# Altium schematic sheet headers.SchDoc
size A; SheetNumber: 2; SheetTotal: 3
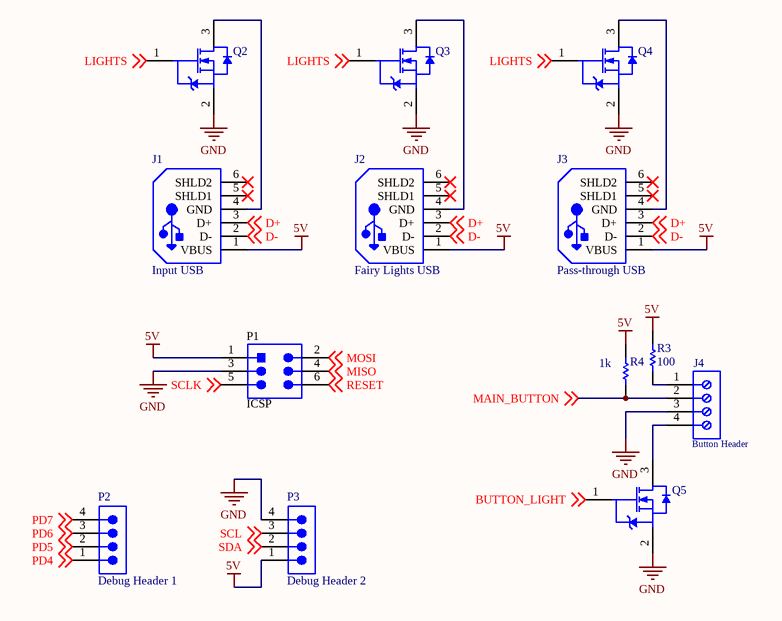
[diagram p0: headers.SchDoc]

## Parts
J1  Input USB  [TE-292303-1_V]
J2  Fairy Lights USB  [TE-292303-1_V]
J3  Pass-through USB  [TE-292303-1_V]
J4  Button Header  [691508110304]
P1  ICSP  [SMTC-TSW-103-08-L-D_V]
P2  Debug Header 1  [SMTC-TSW-104-08-X-S]
P3  Debug Header 2  [SMTC-TSW-104-08-X-S]
Q2  (no value)  [FAIR-FDV303N-3_V]
Q3  (no value)  [FAIR-FDV303N-3_V]
Q4  (no value)  [FAIR-FDV303N-3_V]
Q5  (no value)  [FAIR-FDV303N-3_V]
R3  100  [RESC2013X50X30LL20T20]
R4  1k  [RESC2013X50X30NL20T20]

## Nets
5V: J1.1(VBUS) J2.1(VBUS) J3.1(VBUS) P1.1 P3.1 R3.2 R4.2
GND: J4.3 P1.3 P3.4 Q2.2(S) Q3.2(S) Q4.2(S) Q5.2(S)
BUTTON_LIGHT: Q5.1(G) ; off-sheet BUTTON_LIGHT
D+: J1.3(D+) J2.3(D+) J3.3(D+) ; off-sheet D+
D-: J1.2(D-) J2.2(D-) J3.2(D-) ; off-sheet D-
LIGHTS: Q2.1(G) Q3.1(G) Q4.1(G) ; off-sheet LIGHTS
MAIN_BUTTON: J4.2 R4.1 ; off-sheet MAIN_BUTTON
MISO: P1.4 ; off-sheet MISO
MOSI: P1.2 ; off-sheet MOSI
PD4: P2.1 ; off-sheet PD4
PD5: P2.2 ; off-sheet PD5
PD6: P2.3 ; off-sheet PD6
PD7: P2.4 ; off-sheet PD7
RESET: P1.6 ; off-sheet RESET
SCL: P3.3 ; off-sheet SCL
SCLK: P1.5 ; off-sheet SCLK
SDA: P3.2 ; off-sheet SDA
NetJ1_4: J1.4(GND) Q2.3(D)
NetJ2_4: J2.4(GND) Q3.3(D)
NetJ3_4: J3.4(GND) Q4.3(D)
NetJ4_1: J4.1 R3.1
NetJ4_4: J4.4 Q5.3(D)

Not connected (* = marked no-connect by the designer): J1 5(SHLD1)* 6(SHLD2)*; J2 5(SHLD1)* 6(SHLD2)*; J3 5(SHLD1)* 6(SHLD2)*

## Library data of the parts
J1-J3 = CMP-2000-05404-1: 1 Port Right Angle Through Hole Mount Female Type A USB Connector, 4 Position, -55 to 85 degC, RoHS, Tube; Manufacturer: TE Connectivity; MPN: 292303-1; Contact Termination Type: Solder; No. of Contacts: 4; Connector Mounting: PCB; SVHC: NoSVHC(16-Jun-2014); Gender: Receptacle; Connector Type: USBA; Package Description: 4-Pin Through Hole Device, Body 14 x 13.13 mm, Pitch 2.5 mm; Contact Plating: Gold; Package Reference: 292303-1; Contact Material: Copper; Datasheet URL: http://www.farnell.com/cad/1653030.pdf; Datasheet Version: Feb-12; Manufacturer URL: http://www.te.com/
J4 = CMP-1502-02492-1: Serie 5081 - 3.50 mm Horizontal Entry SMT with Rising Cage Clamp WR-TBL, 4 pin; Manufacturer: Wurth Elektronik; Pitch: 3.50mm; Pin Number: 4; Package Reference: 691508110304; Publisher: WurthElektronik; Part Number: 691508110304; Datasheet URL: http://katalog.we-online.de/em/datasheet/6915081103xx.pdf; Mounting Technology: SMT; Operating Temperature: -40to130degC; Packaging: TapeandReelwithCap; Manufacturer URL: http://www.we-online.de; MPN: 691508110304
P1 = CMP-1024-00336-5: Male Header, Pitch 2.54 mm, 2 x 3 Position, Height 8.38 mm, Tail Length 5.08 mm, -55 to 125 degC, RoHS, Bulk; Manufacturer: Samtec; MPN: TSW-103-08-L-D; DatasheetVersion: 04/2012; ComponentLink3URL: http://suddendocs.samtec.com/prints/tsw-xxx-xx-x-x-xx-xxx-footprint.pdf; PackageReference: TSW-103-08-L-D; Mounting Technology: Through Hole; Min Operating Temperature: -55 degC; ComponentLink2Description: Datasheet; Lead Pitch: 2.54 mm; ComponentLink1Description: Manufacturer URL; Mount: Through Hole; ComponentLink1URL: http://www.samtec.com/; ComponentLink3Description: Package Specification; Max Operating Temperature: 125 degC; PackageDescription: Male Header, Pitch 2.54 mm, 2 x 3 Position, Height 8.38 mm, Tail Length 5.08 mm; ComponentLink2URL: https://datasheet.ciiva.com/25618/0900766b81154476-25618436.pdf; RoHSCompliant: true
P2 P3 = CMP-1024-00356-1: 0.025" SQ Post Header, Through-hole, Vertical, -55 to 105 degC, 2.54 mm Pitch, 4-Pin, Male, RoHS; PartNumber: TSW-104-08-T-S; Manufacturer: Samtec; Pitch: 2.54 mm; PackageDescription: .025[0.64] SQ. Post Terminal Strip Assembly; ComponentLink2URL: http://www.samtec.com/documents/webfiles/pdf/TSW_TH.PDF; ComponentLink3URL: http://www.samtec.com/documents/webfiles/cpdf/TSW-XXX-XX-XXX-X-XX-XXX-MKT.pdf; PackageVersion: DM, 8/1988; ComponentLink3Description: Package Specification; DatasheetVersion: F-214; Orientation: Vertical; RoHS: True; Mounting Technology: Through-hole; ComponentLink1URL: http://www.samtec.com; ComponentLink1Description: Manufacturer URL; Temperature Range: -55 to 105 degC; ComponentLink2Description: Datasheet; PackageReference: TSW-104-08-X-S; MPN: TSW-104-08-T-S
Q2-Q5 = CMP-2000-05111-1: N-Channel MOSFET Transistor, 8 V VGSS, 25 V VDSS, 0.68 A, -55 to 150 degC, 3-Pin SOT23, RoHS, Tape and Reel; Manufacturer: Fairchild; MPN: FDV303N; Typical Turn-On Delay Time: 3ns; Channel Mode: Enhancement; RDS-on: 450@4.5VmOhm; Maximum Continuous Drain Current: 0.68A; Maximum Drain Source Voltage: 25V; Rad Hard: No; Typical Fall Time: 13ns; Channel Type: N; Typical Turn-Off Delay Time: 17ns; Maximum Gate Source Voltage: 8V; Typical Rise Time: 8.5ns; Mounting: SurfaceMount; Packaging: Tape&Reel; Manufacturer URL: https://www.fairchildsemi.com/; Datasheet URL: https://datasheet.ciiva.com/22681/1845307-22681736.pdf; Package: 3SOT-23; Category: MOSFET; Operating Temperature: -55to150degC; Datasheet Version: Rev. D2, 07/2014
R3 = CMP-2001-04901-1: Manufacturer: Vishay Dale; Part Number: CRCW0805100RFKEA; MPN: CRCW0805100RFKEA
R4 = CMP-1013-00510-2: Part Number: CRCW08051K00FKEA; Manufacturer: Vishay Dale; MPN: CRCW08051K00FKEA